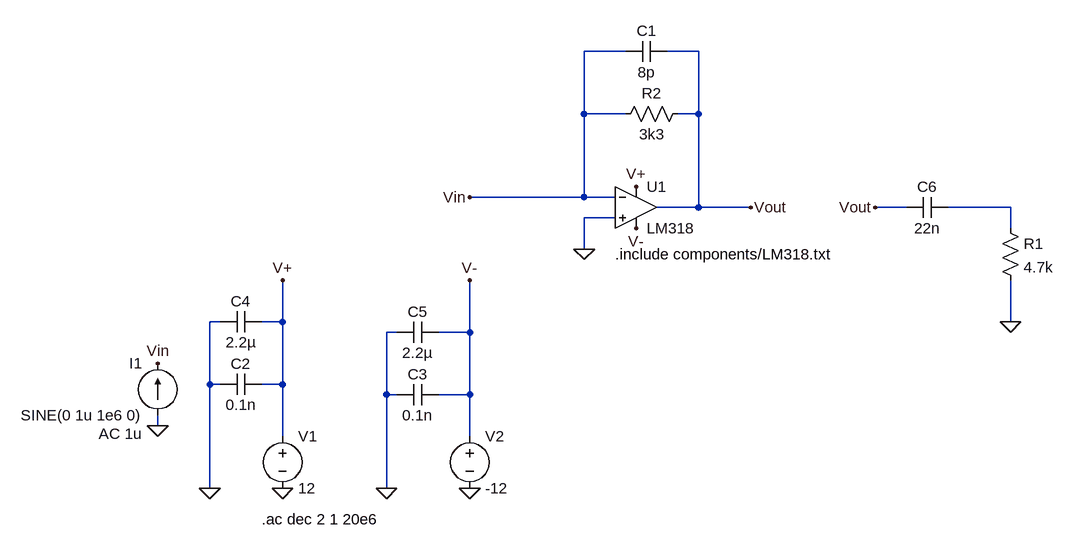
[diagram p0: schematic stage-2-LM6171A-inverting-op-amp.asc]
stage-2-LM6171A-inverting-op-amp.asc, the LTspice schematic file:
Version 4
SHEET 1 992 680
WIRE 288 -128 224 -128
WIRE 400 -128 352 -128
WIRE 224 -32 224 -128
WIRE 288 -32 224 -32
WIRE 400 -32 400 -128
WIRE 400 -32 368 -32
WIRE 224 96 224 -32
WIRE 224 96 48 96
WIRE 272 96 224 96
WIRE 400 112 400 -32
WIRE 400 112 336 112
WIRE 480 112 400 112
WIRE 720 112 672 112
WIRE 880 112 784 112
WIRE 272 128 224 128
WIRE 880 144 880 112
WIRE 224 176 224 128
WIRE -336 288 -352 288
WIRE -240 288 -240 224
WIRE -240 288 -272 288
WIRE 880 288 880 224
WIRE -64 304 -80 304
WIRE 48 304 48 224
WIRE 48 304 0 304
WIRE -352 384 -352 288
WIRE -336 384 -352 384
WIRE -240 384 -240 288
WIRE -240 384 -272 384
WIRE -80 400 -80 304
WIRE -64 400 -80 400
WIRE 48 400 48 304
WIRE 48 400 0 400
WIRE -432 448 -432 432
WIRE -240 464 -240 384
WIRE 48 464 48 400
WIRE -352 544 -352 384
WIRE -80 544 -80 400
FLAG 304 80 V+
FLAG -240 224 V+
FLAG -240 544 0
FLAG 48 544 0
FLAG 304 144 V-
FLAG 48 224 V-
FLAG 224 176 0
FLAG 48 96 Vin
FLAG -432 352 Vin
FLAG -432 448 0
FLAG -352 544 0
FLAG -80 544 0
FLAG 480 112 Vout
FLAG 672 112 Vout
FLAG 880 288 0
DATAFLAG 64 432 ""
SYMBOL OpAmps\\opamp2 304 48 R0
SYMATTR InstName U1
SYMATTR Value LM318
SYMBOL voltage -240 448 R0
WINDOW 123 0 0 Left 0
WINDOW 39 0 0 Left 0
SYMATTR InstName V1
SYMATTR Value 12
SYMBOL voltage 48 448 R0
WINDOW 123 0 0 Left 0
WINDOW 39 0 0 Left 0
SYMATTR InstName V2
SYMATTR Value -12
SYMBOL res 384 -48 R90
WINDOW 0 0 56 VBottom 2
WINDOW 3 32 56 VTop 2
SYMATTR InstName R2
SYMATTR Value 3k3
SYMBOL cap 352 -144 R90
WINDOW 0 0 32 VBottom 2
WINDOW 3 32 32 VTop 2
SYMATTR InstName C1
SYMATTR Value 8p
SYMBOL current -432 432 R180
WINDOW 0 24 80 Left 2
WINDOW 3 24 0 Left 2
WINDOW 123 24 -28 Left 2
WINDOW 39 0 0 Left 0
SYMATTR InstName I1
SYMATTR Value SINE(0 1u 1e6 0)
SYMATTR Value2 AC 1u
SYMBOL cap -272 368 R90
WINDOW 0 0 32 VBottom 2
WINDOW 3 32 32 VTop 2
SYMATTR InstName C2
SYMATTR Value 0.1n
SYMBOL cap 0 384 R90
WINDOW 0 0 32 VBottom 2
WINDOW 3 32 32 VTop 2
SYMATTR InstName C3
SYMATTR Value 0.1n
SYMBOL cap -272 272 R90
WINDOW 0 0 32 VBottom 2
WINDOW 3 32 32 VTop 2
SYMATTR InstName C4
SYMATTR Value 2.2µ
SYMBOL cap 0 288 R90
WINDOW 0 0 32 VBottom 2
WINDOW 3 32 32 VTop 2
SYMATTR InstName C5
SYMATTR Value 2.2µ
SYMBOL cap 784 96 R90
WINDOW 0 0 32 VBottom 2
WINDOW 3 32 32 VTop 2
SYMATTR InstName C6
SYMATTR Value 22n
SYMBOL res 864 128 R0
SYMATTR InstName R1
SYMATTR Value 4.7k
TEXT 272 184 Left 2 !.include components/LM318.txt
TEXT -272 592 Left 2 !.ac dec 2 1 20e6

The netlist it stands for:
* stage-2-LM6171A-inverting-op-amp.asc
XU1 0 Vin V+ V- Vout LM318  ; pins In+ In- V+ V- OUT
V1 V+ 0 12
V2 V- 0 -12
R2 Vout Vin 3k3
C1 Vout Vin 8p
I1 0 Vin SINE(0 1u 1e6 0) AC 1u
C2 V+ 0 0.1n
C3 V- 0 0.1n
C4 V+ 0 2.2µ
C5 V- 0 2.2µ
C6 N001 Vout 22n
R1 N001 0 4.7k
.include components/LM318.txt
.ac dec 2 1 20e6
.backanno
.end